# EasyEDA schematic USB Flash Drive Replacer.json
TITLE: USB Flash Drive Replacer; REV: 1.0; Date: 2022-03-27; Sheet: 1/1; Drawn By: philbobagins
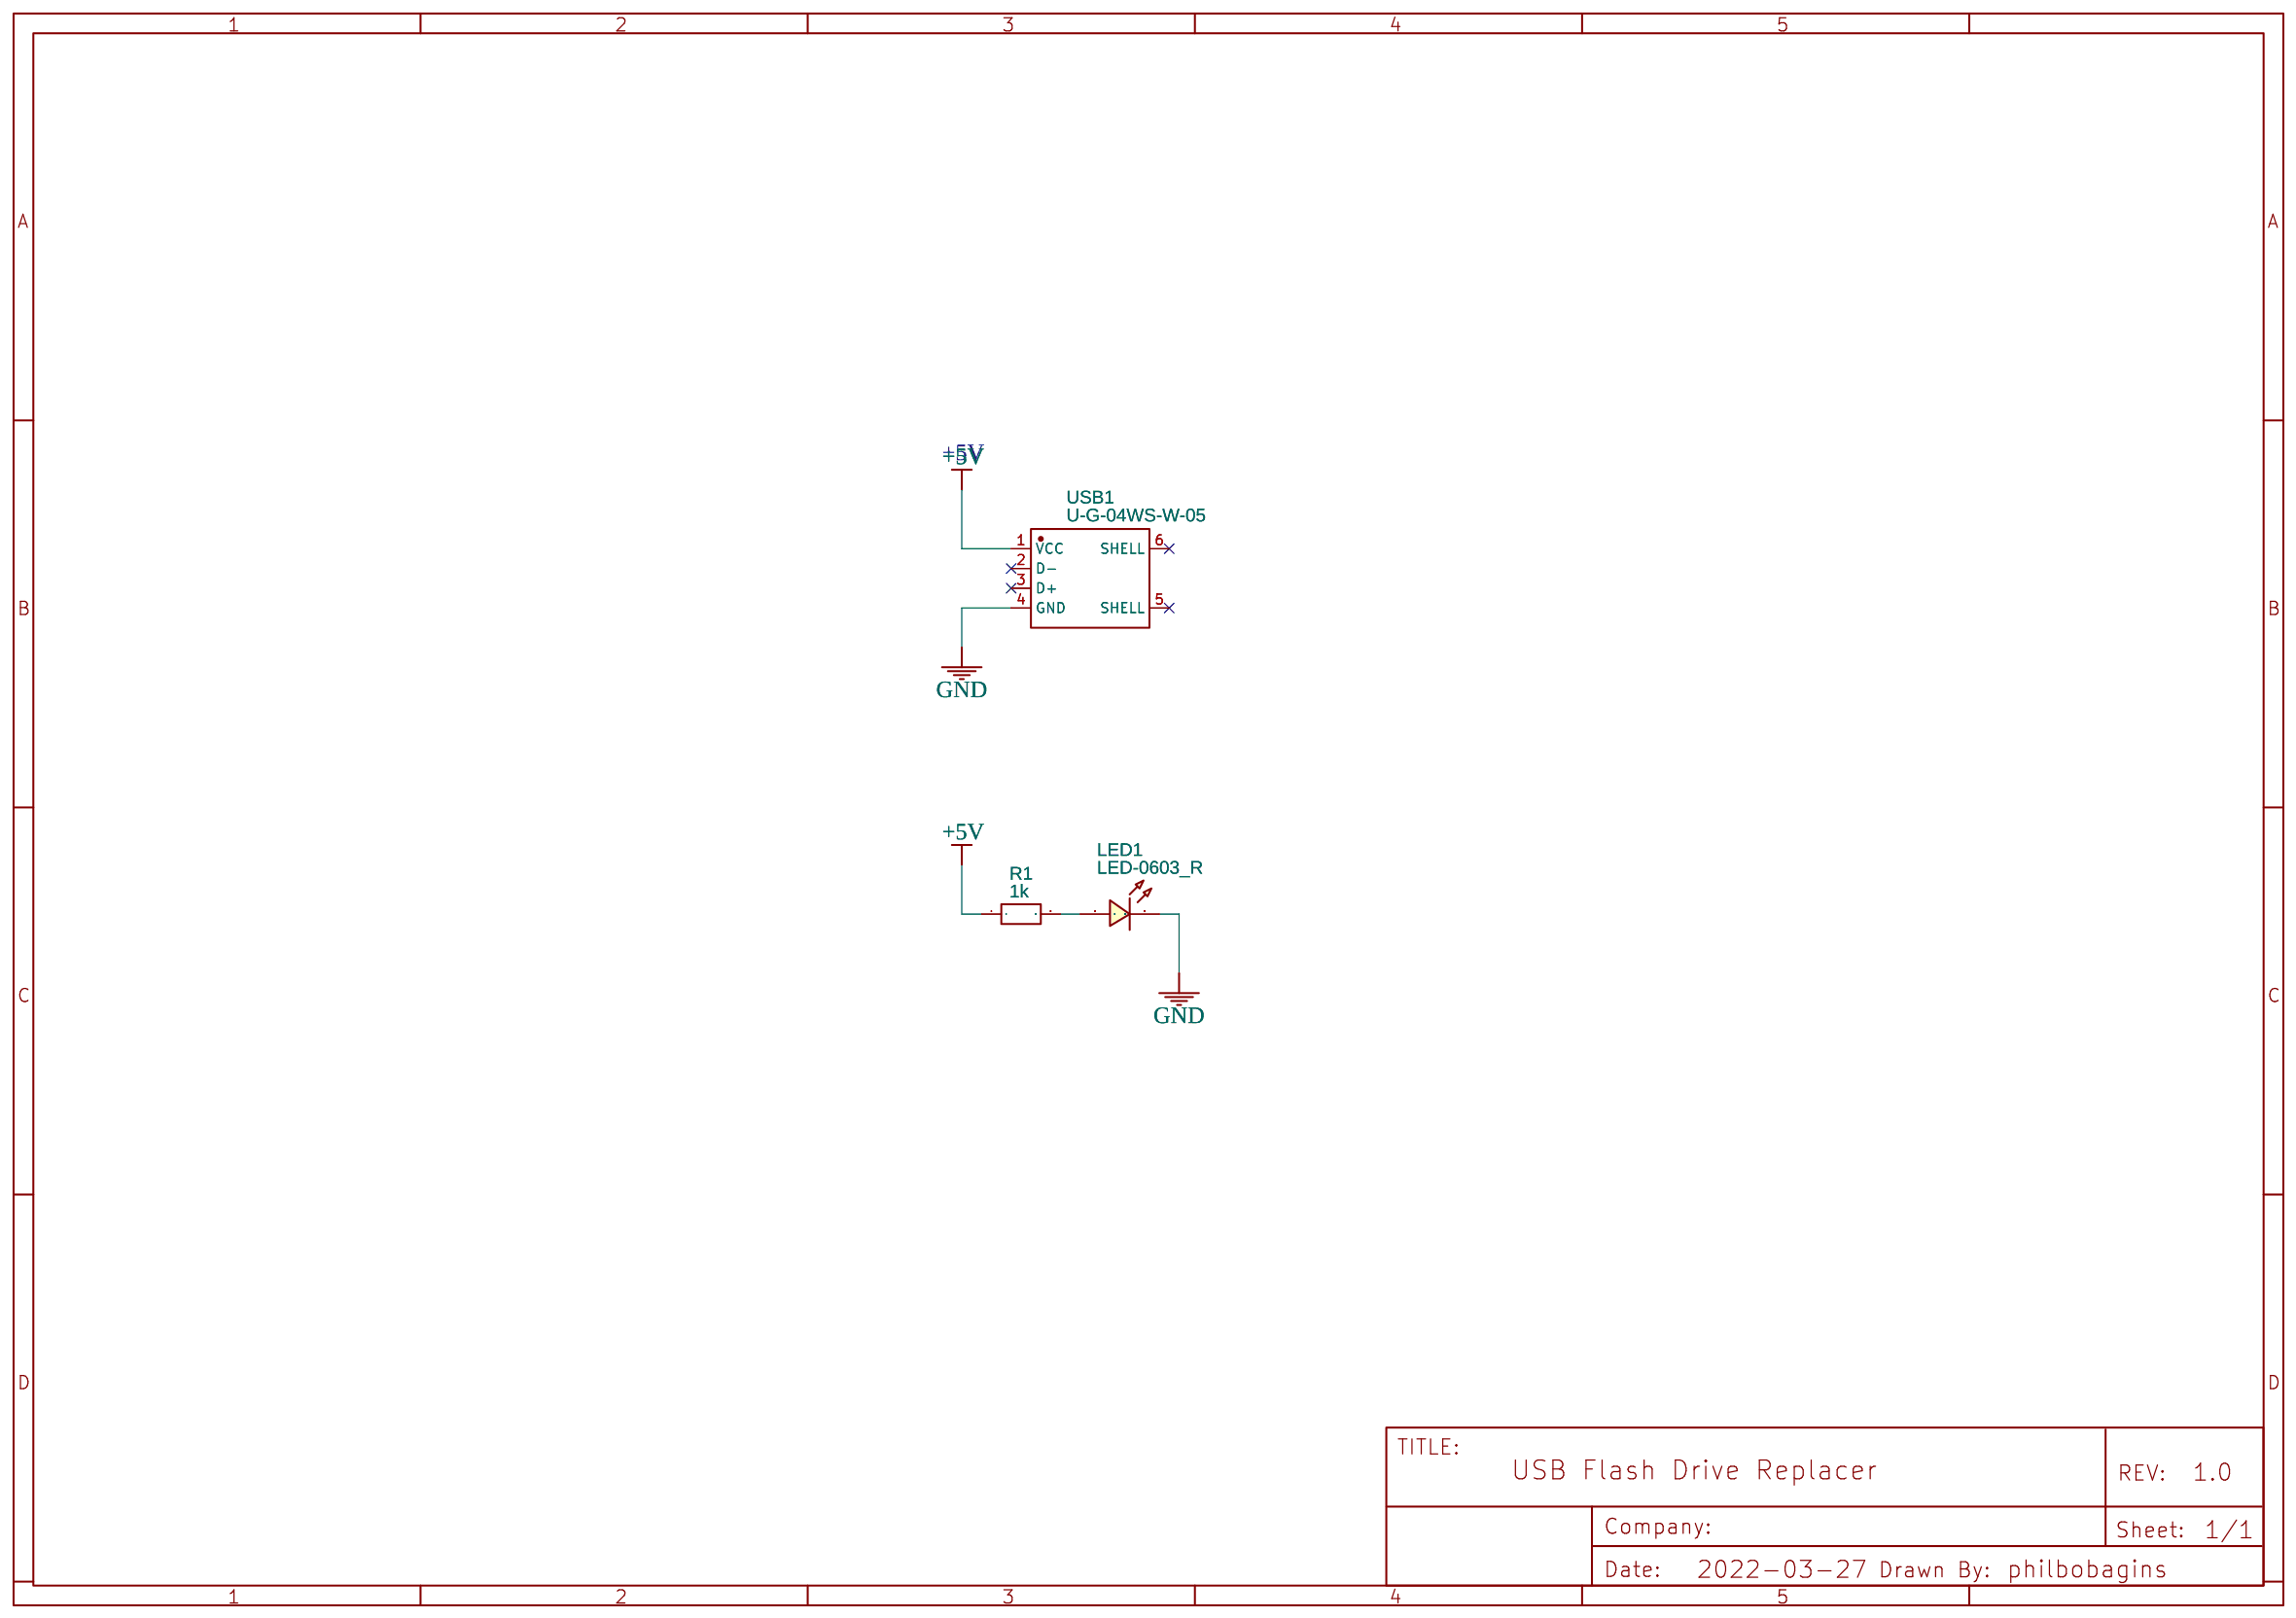
[diagram p0: schematic sheet]

## Parts
LED1  LED-0603_R  [LED0603_RED]
R1  1k  [R0805]
USB1  U-G-04WS-W-05  [USB-A-SMD_U-G-04WS-W-05]

## Library data of the parts
LED1 = LED-0603_R: Manufacturer: EVERLIGHT(台湾亿光); Manufacturer Part: 19-217/R6C-AL1M2VY/3T; Supplier Part: C72044; Supplier: LCSC; Contributor: LCEDA_01
R1 = R_0805_EU: Supplier Part: C17513; Supplier: LCSC; Contributor: LCEDA_Lib; Manufacturer Part: 0805W8F1001T5E; Manufacturer: UniOhm
USB1 = U-G-04WS-W-05: Supplier: LCSC; Supplier Part: C283547; Manufacturer: 韩国韩荣; Contributor: LCSC; JLCPCB Part Class: Extended Part

## Nets
+5V: R1.1 USB1.1(VCC)
GND: LED1.2 USB1.4(GND)
Net-(LED1-1): LED1.1 R1.2

Not connected (* = marked no-connect by the designer): USB1 2(D-)* 3(D+)* 5(SHELL)* 6(SHELL)*

## Notes on the sheet
- +5V
